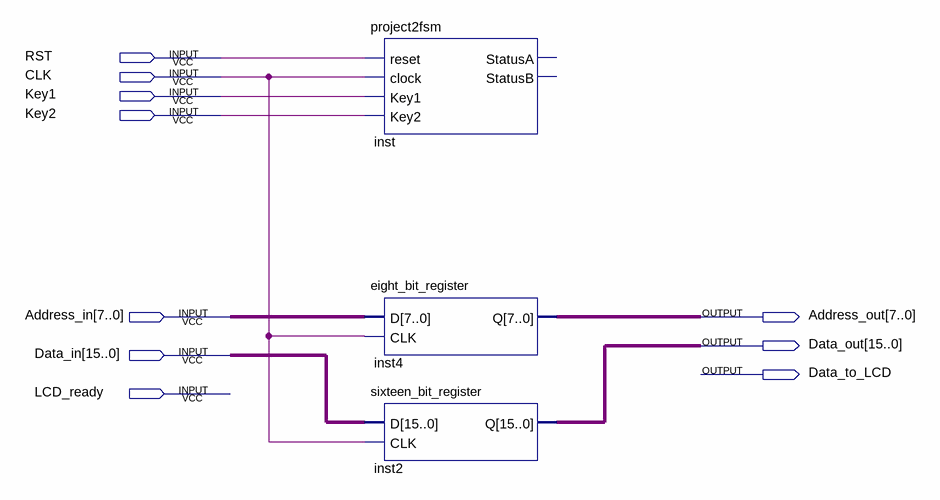
[diagram p0: schematic sheet]
// Quartus schematic pproject2.bdf as structural Verilog: 3 symbols, 10 pins
module pproject2 (
  input  RST,
  input  CLK,
  input  Key1,
  input  Key2,
  input  [7:0] Address_in,
  input  [15:0] Data_in,
  input  LCD_ready,
  output [7:0] Address_out,
  output [15:0] Data_out,
  output Data_to_LCD
);

  project2fsm inst (.reset(RST), .clock(CLK), .Key1(Key1), .Key2(Key2));  // open: StatusA, StatusB
  eight_bit_register inst4 (.D(Address_in), .CLK(CLK), .Q(Address_out));
  sixteen_bit_register inst2 (.D(Data_in), .CLK(CLK), .Q(Data_out));
endmodule
